# EAGLE schematic ASD2123 (EAGLE 6.3)
DATABASE: ./../../../../../Components/TinyCircuits_Part_Database.txt
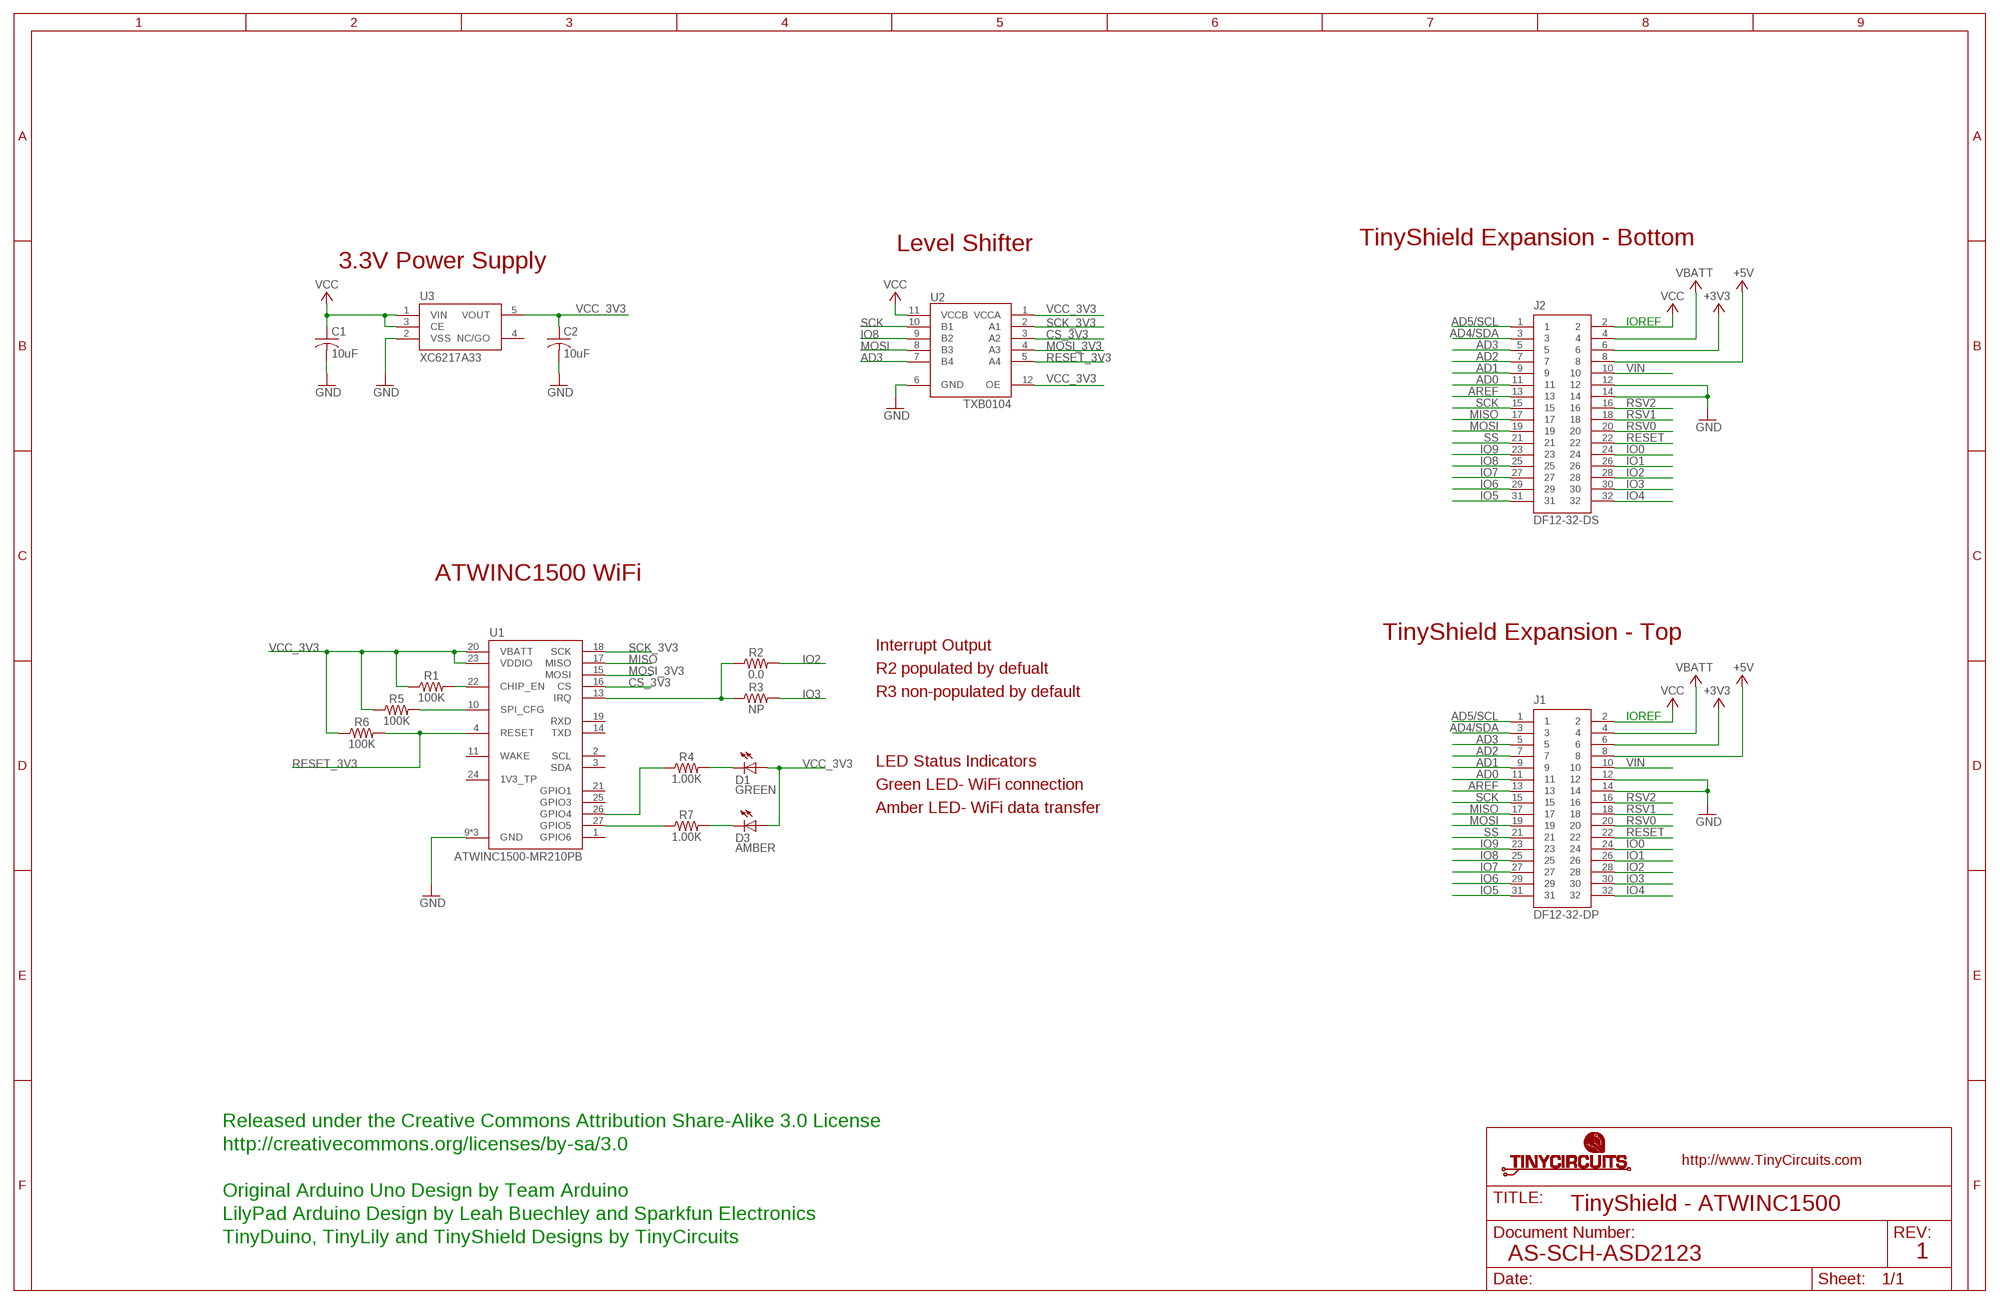
[diagram p0: schematic, sheet 1]

## Parts
C1  10uF  AS-ITM-00002  [C0603]
C2  10uF  AS-ITM-00002  [C0603]
D1  GREEN  AS-ITM-00038  [0402_LED]
D3  AMBER  AS-ITM-00058  [0402_LED]
J1  DF12-32-DP  AS-ITM-00015  [DF12-32-DP]
J2  DF12-32-DS  AS-ITM-00012  [DF12-32-DS]
R1  100K  AS-ITM-00004  [0402]
R2  0.0  AS-ITM-00076  [0402]
R3  NP  AS-ITM-00076  [0402]
R4  1.00K  AS-ITM-00003  [0402]
R5  100K  AS-ITM-00004  [0402]
R6  100K  AS-ITM-00004  [0402]
R7  1.00K  AS-ITM-00003  [0402]
U1  ATWINC1500-MR210PB  AS-ITM-00292  [ATWINC1500-MR210PB]
U2  TXB0104  AS-ITM-00048  [UQFN-12]
U3  XC6217A33  AS-ITM-00046  [SOT-25]

## Nets
+3V3: J1.6 J2.6
+5V: J1.8 J2.8
AD0: J1.11 J2.11
AD1: J1.9 J2.9
AD2: J1.7 J2.7
AD3: J1.5 J2.5 U2.7(B4)
AD4/SDA: J1.3 J2.3
AD5/SCL: J1.1 J2.1
AREF: J1.13 J2.13
CS_3V3: U1.16(CS) U2.3(A2)
GND: C1.2 C2.2 J1.12 J1.14 J2.12 J2.14 U1.9(GND) U1.12(GND) U1.28(GND) U2.6(GND) U3.2(VSS)
IO0: J1.24 J2.24
IO1: J1.26 J2.26
IO2: J1.28 J2.28 R2.2
IO3: J1.30 J2.30 R3.2
IO4: J1.32 J2.32
IO5: J1.31 J2.31
IO6: J1.29 J2.29
IO7: J1.27 J2.27
IO8: J1.25 J2.25 U2.9(B2)
IO9: J1.23 J2.23
IRQ: R2.1 R3.1 U1.13(IRQ)
MISO: J1.17 J2.17 U1.17(MISO)
MOSI: J1.19 J2.19 U2.8(B3)
MOSI_3V3: U1.15(MOSI) U2.4(A3)
N$1: R1.2 U1.22(CHIP_EN)
N$2: R4.1 U1.26(GPIO4)
N$3: R7.1 U1.27(GPIO5)
N$4: R5.2 U1.10(SPI_CFG)
N$8: D1.2(C) R4.2
N$9: D3.2(C) R7.2
RESET: J1.22 J2.22
RESET_3V3: R6.2 U1.4(RESET) U2.5(A4)
RSV0: J1.20 J2.20
RSV1: J1.18 J2.18
RSV2: J1.16 J2.16
SCK: J1.15 J2.15 U2.10(B1)
SCK_3V3: U1.18(SCK) U2.2(A1)
SS: J1.21 J2.21
VBATT: J1.4 J2.4
VCC: C1.1 J1.2 J2.2 U2.11(VCCB) U3.1(VIN) U3.3(CE)
VCC_3V3: C2.1 D1.1(A) D3.1(A) R1.1 R5.1 R6.1 U1.20(VBATT) U1.23(VDDIO) U2.1(VCCA) U2.12(OE) U3.5(VOUT)
VIN: J1.10 J2.10
Unconnected: U1.1(GPIO6) U1.2(SCL) U1.3(SDA) U1.11(WAKE) U1.14(TXD) U1.19(RXD) U1.21(GPIO1) U1.24(1V3_TP) U1.25(GPIO3) U3.4(NC/GO)

## Notes on the sheet
- Level Shifter | TinyShield Expansion - Bottom
- 3.3V Power Supply
- IOREF
- ATWINC1500 WiFi
- TinyShield Expansion - Top
- Interrupt Output
- R2 populated by defualt
- R3 non-populated by default
- IOREF
- LED Status Indicators
- Green LED- WiFi connection
- Amber LED- WiFi data transfer
- Released under the Creative Commons Attribution Share-Alike 3.0 License
- http://creativecommons.org/licenses/by-sa/3.0
- Original Arduino Uno Design by Team Arduino
- TinyShield - ATWINC1500
- LilyPad Arduino Design by Leah Buechley and Sparkfun Electronics
- TinyDuino, TinyLily and TinyShield Designs by TinyCircuits
- AS-SCH-ASD2123 | 1

## Library data of the parts
C1 C2 = tinycircuits:AS-ITM-00002: CAP CER 10UF 10V 20% X5R 0603; PARTNO: AS-ITM-00002
D1 = tinycircuits:AS-ITM-00038: LED 0402 GREEN WTR CLR SMD; PARTNO: AS-ITM-00038
D3 = tinycircuits:AS-ITM-00058: LED 0402 AMBER WTR CLR SMD; PARTNO: AS-ITM-00058
J1 = tinycircuits:AS-ITM-00015: CONN HEADER 32POS 3MM SMD 0.5MM; PARTNO: AS-ITM-00015
J2 = tinycircuits:AS-ITM-00012: CONN RECEPT 32POS 3MM SMD 0.5MM; PARTNO: AS-ITM-00012
R1 R5 R6 = tinycircuits:AS-ITM-00004: RES 100K OHM 1/16W 1% 0402; PARTNO: AS-ITM-00004
R2 = tinycircuits:AS-ITM-00076: RES 0.0 OHM 1/16W 1% 0402 SMD; PARTNO: AS-ITM-00076
R3 = tinycircuits:AS-ITM-00076: RES 0.0 OHM 1/16W 1% 0402 SMD; PARTNO: AS-ITM-00076; VALUE: 0.0
R4 R7 = tinycircuits:AS-ITM-00003: RES 1.00K OHM 1/16W 1% 0402; PARTNO: AS-ITM-00003
U1 = tinycircuits:AS-ITM-00292: SMART MODULE ATWINC1500B-MU-T; PARTNO: AS-ITM-00292
U2 = tinycircuits:AS-ITM-00048: IC VOLT-LEVEL TRANSLATOR 12UQFN; PARTNO: AS-ITM-00048
U3 = tinycircuits:AS-ITM-00046: IC REG LDO 3.3V .7A SOT-25; PARTNO: AS-ITM-00046; PNPROTATION: 270; VALUE: XC6210B33